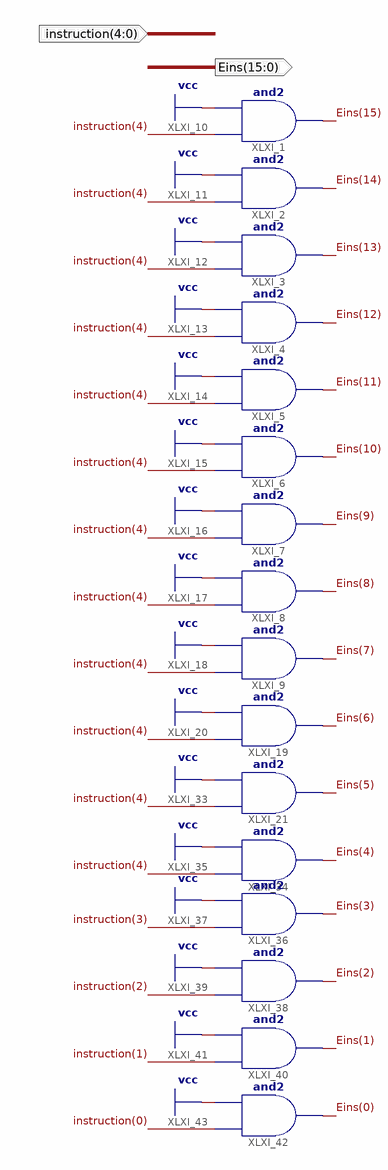
[diagram p0: schematic sheet 1]
// Xilinx ISE schematic sign_extender5_16.sch (spartan6) as structural Verilog: 16 symbols, 3 ports
module sign_extender5_16 (
  inout  [4:0] instruction,
  output [15:0] Eins
);

  and XLXI_1 (Eins[15], 1'b1, instruction[4]);
  and XLXI_2 (Eins[14], 1'b1, instruction[4]);
  and XLXI_3 (Eins[13], 1'b1, instruction[4]);
  and XLXI_4 (Eins[12], 1'b1, instruction[4]);
  and XLXI_5 (Eins[11], 1'b1, instruction[4]);
  and XLXI_6 (Eins[10], 1'b1, instruction[4]);
  and XLXI_7 (Eins[9], 1'b1, instruction[4]);
  and XLXI_8 (Eins[8], 1'b1, instruction[4]);
  and XLXI_9 (Eins[7], 1'b1, instruction[4]);
  and XLXI_19 (Eins[6], 1'b1, instruction[4]);
  and XLXI_21 (Eins[5], 1'b1, instruction[4]);
  and XLXI_34 (Eins[4], 1'b1, instruction[4]);
  and XLXI_36 (Eins[3], 1'b1, instruction[3]);
  and XLXI_38 (Eins[2], 1'b1, instruction[2]);
  and XLXI_40 (Eins[1], 1'b1, instruction[1]);
  and XLXI_42 (Eins[0], 1'b1, instruction[0]);
endmodule
